# Altium schematic sheet 03 CPU.SchDoc
size 420 x 297 mm
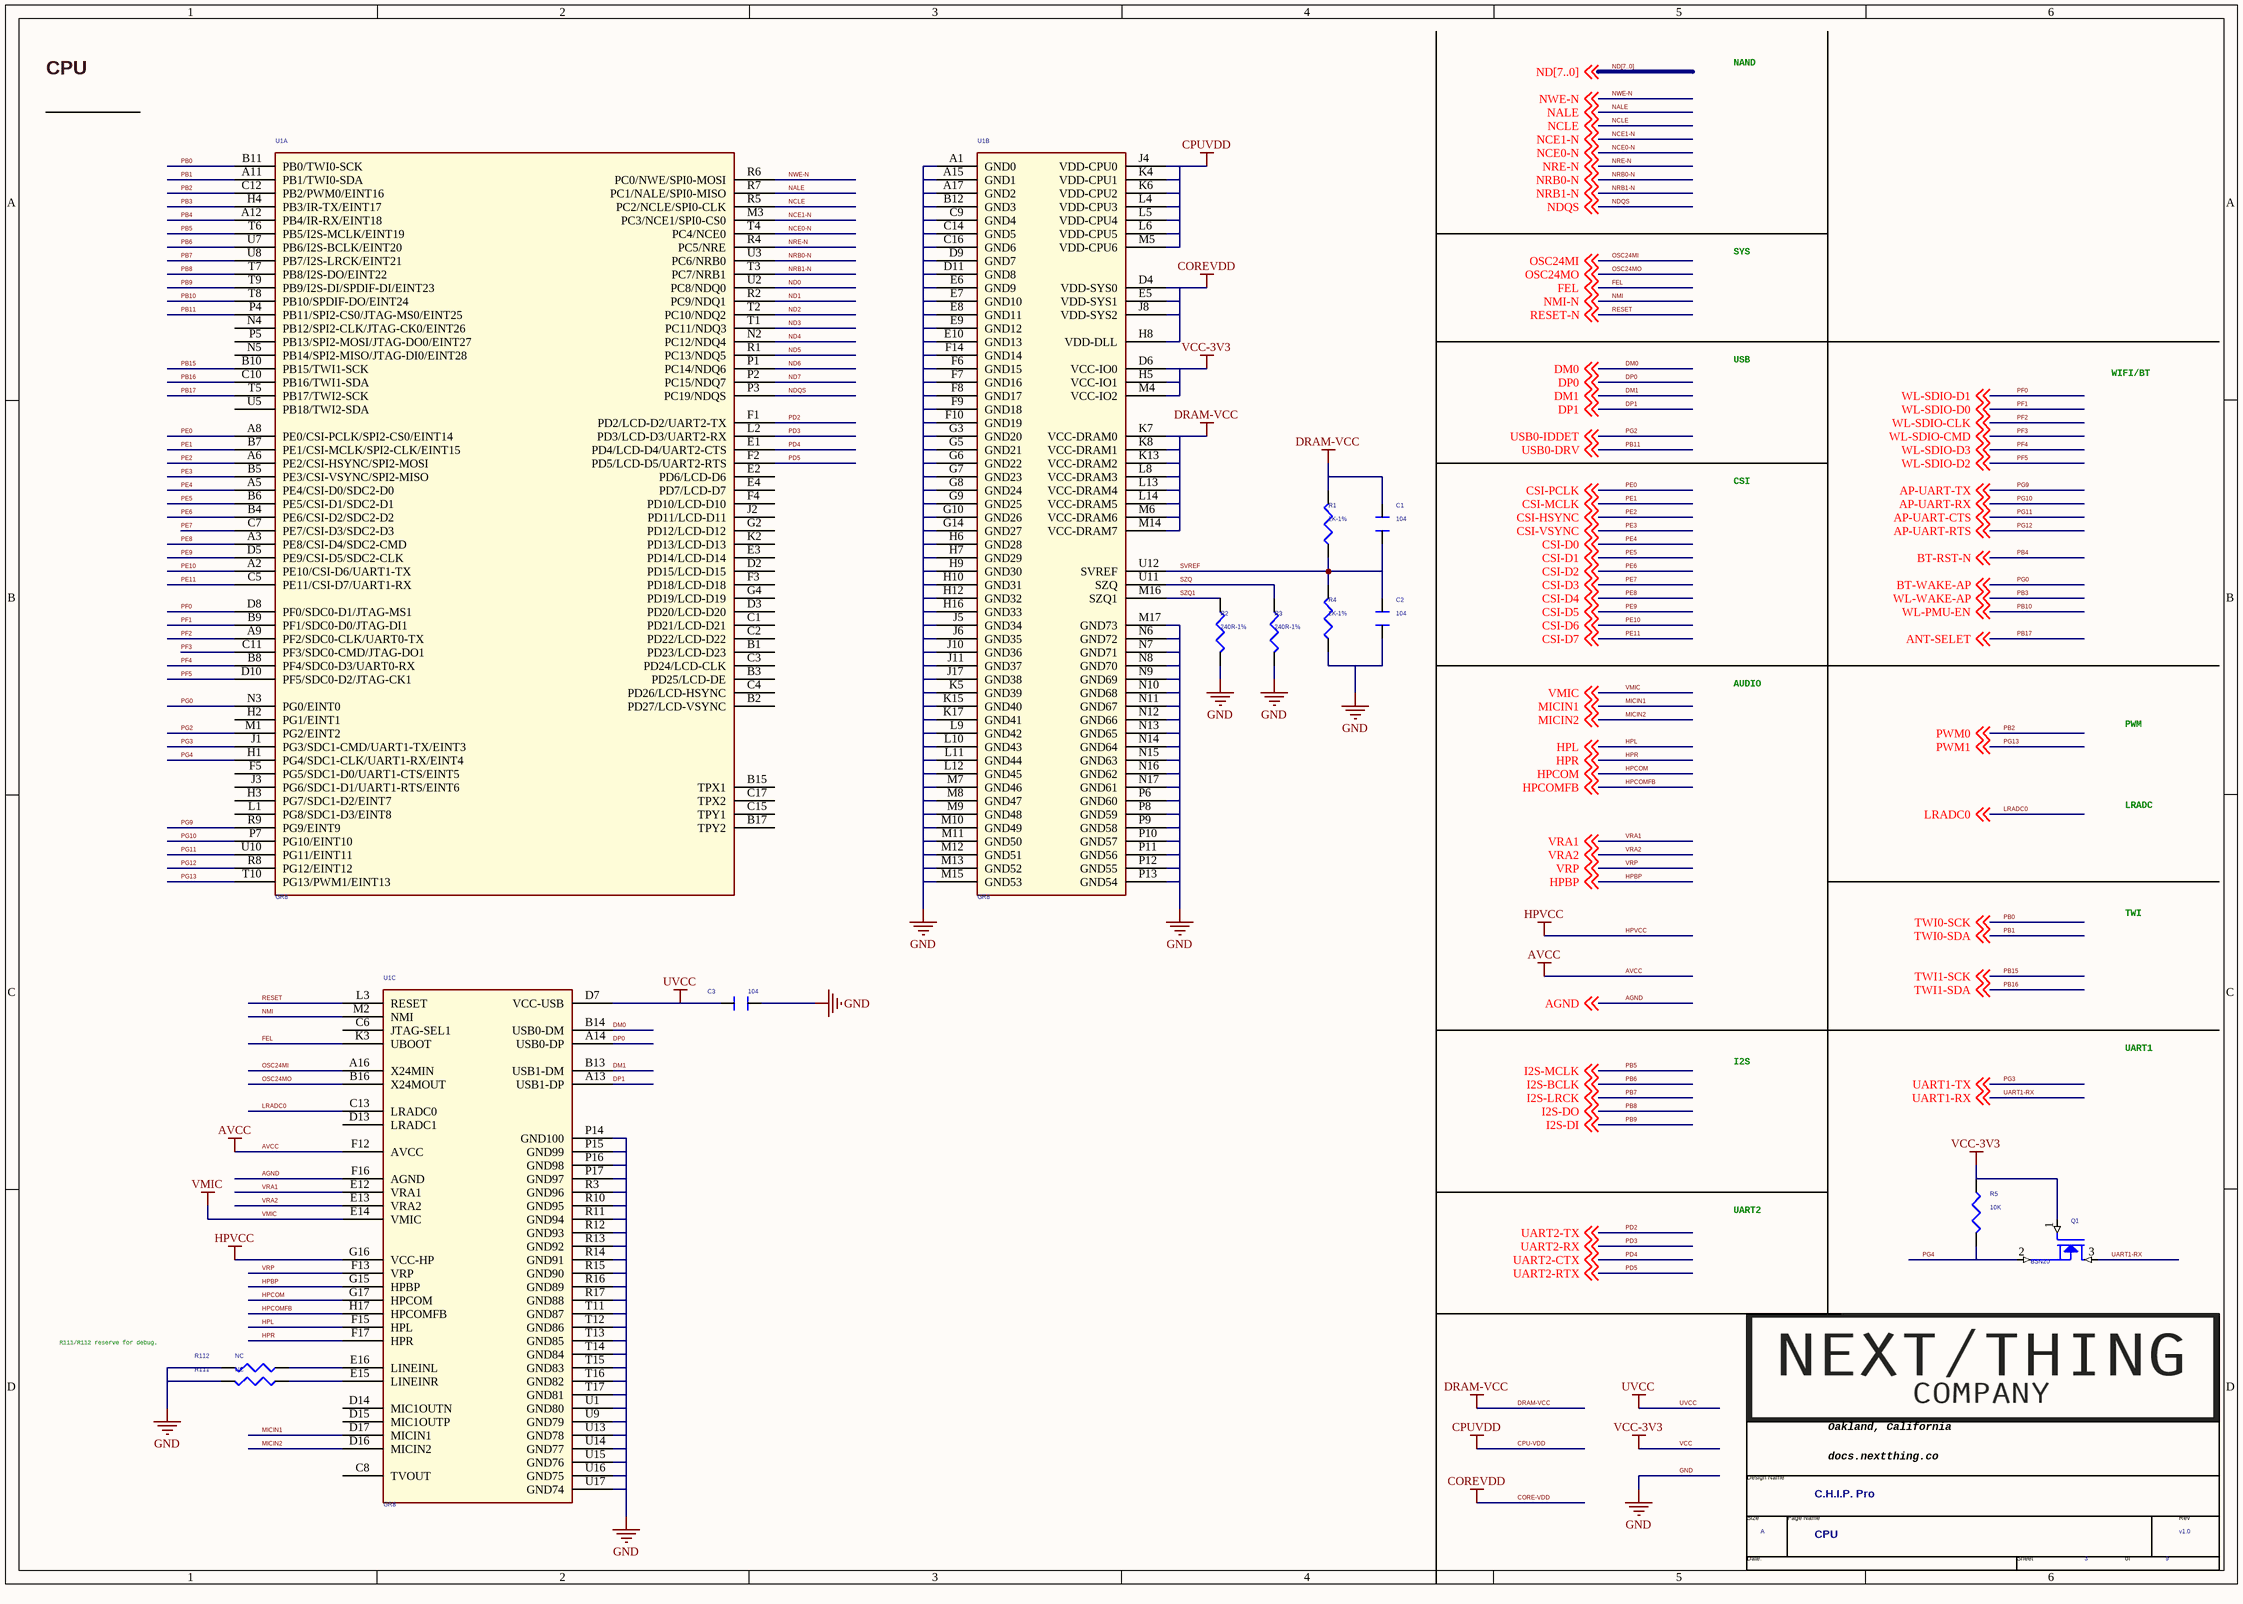
[diagram p0: 03 CPU.SchDoc]

## Parts
*  Page Count: 9  Page Number: 3  Page Size: A  Title: C.H.I.P. Pro  RevCode: v1.0  Doc: CPU  (hidden comment: TitleBlock1-nextthing)  (graphical)
C1  104  [0805]
C2  104  [0805]
C3  104  [C0201]
Q1  BSN20  [sot-23]
R1  2K-1%  [0805]
R2  240R-1%  [R0201]
R3  240R-1%  [R0201]
R4  2K-1%  [0805]
R5  10K  [0805]
R111  NC  [R0603]
R112  NC  [R0603]
U1  GR8  [BGA252P80B1400_1400]  (parts A,B,C of 3)

## Nets
AVCC: U1.F12(AVCC)
CORE-VDD: U1.D4(VDD-SYS0) U1.E5(VDD-SYS1) U1.H8(VDD-DLL) U1.J8(VDD-SYS2)  [also labelled COREVDD]
CPU-VDD: U1.J4(VDD-CPU0) U1.K4(VDD-CPU1) U1.K6(VDD-CPU2) U1.L4(VDD-CPU3) U1.L5(VDD-CPU4) U1.L6(VDD-CPU5) U1.M5(VDD-CPU6)  [also labelled CPUVDD]
DRAM-VCC: C1.1 R1.2 U1.K7(VCC-DRAM0) U1.K8(VCC-DRAM1) U1.K13(VCC-DRAM2) U1.L8(VCC-DRAM3) U1.L13(VCC-DRAM4) U1.L14(VCC-DRAM5) U1.M6(VCC-DRAM6) U1.M14(VCC-DRAM7)
GND: C2.2 C3.1 R2.1 R3.1 R4.1 R111.2 R112.1 U1.A1(GND0) U1.A15(GND1) U1.A17(GND2) U1.B12(GND3) U1.C9(GND4) U1.C14(GND5) U1.C16(GND6) U1.D9(GND7) U1.D11(GND8) U1.E6(GND9) U1.E7(GND10) U1.E8(GND11) U1.E9(GND12) U1.E10(GND13) U1.F6(GND15) U1.F7(GND16) U1.F8(GND17) U1.F9(GND18) U1.F10(GND19) U1.F14(GND14) U1.G3(GND20) U1.G5(GND21) U1.G6(GND22) U1.G7(GND23) U1.G8(GND24) U1.G9(GND25) U1.G10(GND26) U1.G14(GND27) U1.H6(GND28) U1.H7(GND29) U1.H9(GND30) U1.H10(GND31) U1.H12(GND32) U1.H16(GND33) U1.J5(GND34) U1.J6(GND35) U1.J10(GND36) U1.J11(GND37) U1.J17(GND38) U1.K5(GND39) U1.K15(GND40) U1.K17(GND41) U1.L9(GND42) U1.L10(GND43) U1.L11(GND44) U1.L12(GND45) U1.M7(GND46) U1.M8(GND47) U1.M9(GND48) U1.M10(GND49) U1.M11(GND50) U1.M12(GND51) U1.M13(GND52) U1.M15(GND53) U1.M17(GND73) U1.N6(GND72) U1.N7(GND71) U1.N8(GND70) U1.N9(GND69) U1.N10(GND68) U1.N11(GND67) U1.N12(GND66) U1.N13(GND65) U1.N14(GND64) U1.N15(GND63) U1.N16(GND62) U1.N17(GND61) U1.P6(GND60) U1.P8(GND59) U1.P9(GND58) U1.P10(GND57) U1.P11(GND56) U1.P12(GND55) U1.P13(GND54) U1.P14(GND100) U1.P15(GND99) U1.P16(GND98) U1.P17(GND97) U1.R3(GND96) U1.R10(GND95) U1.R11(GND94) U1.R12(GND93) U1.R13(GND92) U1.R14(GND91) U1.R15(GND90) U1.R16(GND89) U1.R17(GND88) U1.T11(GND87) U1.T12(GND86) U1.T13(GND85) U1.T14(GND84) U1.T15(GND83) U1.T16(GND82) U1.T17(GND81) U1.U1(GND80) U1.U9(GND79) U1.U13(GND78) U1.U14(GND77) U1.U15(GND76) U1.U16(GND75) U1.U17(GND74)
HPVCC: U1.G16(VCC-HP)
UVCC: C3.2 U1.D7(VCC-USB)
VCC: Q1.1(GATE) R5.1 U1.D6(VCC-IO0) U1.H5(VCC-IO1) U1.M4(VCC-IO2)  [also labelled VCC-3V3]
VMIC: U1.E14(VMIC) ; off-sheet VMIC
AGND: U1.F16(AGND) ; off-sheet AGND
DM0: U1.B14(USB0-DM) ; off-sheet DM0
DM1: U1.B13(USB1-DM) ; off-sheet DM1
DP0: U1.A14(USB0-DP) ; off-sheet DP0
DP1: U1.A13(USB1-DP) ; off-sheet DP1
FEL: U1.K3(UBOOT) ; off-sheet FEL
HPBP: U1.G15(HPBP) ; off-sheet HPBP
HPCOM: U1.G17(HPCOM) ; off-sheet HPCOM
HPCOMFB: U1.H17(HPCOMFB) ; off-sheet HPCOMFB
HPL: U1.F15(HPL) ; off-sheet HPL
HPR: U1.F17(HPR) ; off-sheet HPR
LRADC0: U1.C13(LRADC0) ; off-sheet LRADC0
MICIN1: U1.D17(MICIN1) ; off-sheet MICIN1
MICIN2: U1.D16(MICIN2) ; off-sheet MICIN2
NALE: U1.R7(PC1/NALE/SPI0-MISO) ; off-sheet NALE
NCE0-N: U1.T4(PC4/NCE0) ; off-sheet NCE0-N
NCE1-N: U1.M3(PC3/NCE1/SPI0-CS0) ; off-sheet NCE1-N
NCLE: U1.R5(PC2/NCLE/SPI0-CLK) ; off-sheet NCLE
ND0: U1.U2(PC8/NDQ0)
ND1: U1.R2(PC9/NDQ1)
ND2: U1.T2(PC10/NDQ2)
ND3: U1.T1(PC11/NDQ3)
ND4: U1.N2(PC12/NDQ4)
ND5: U1.R1(PC13/NDQ5)
ND6: U1.P1(PC14/NDQ6)
ND7: U1.P2(PC15/NDQ7)
NDQS: U1.P3(PC19/NDQS) ; off-sheet NDQS
NMI: U1.M2(NMI) ; off-sheet NMI-N  [also labelled NMI-N]
NRB0-N: U1.U3(PC6/NRB0) ; off-sheet NRB0-N
NRB1-N: U1.T3(PC7/NRB1) ; off-sheet NRB1-N
NRE-N: U1.R4(PC5/NRE) ; off-sheet NRE-N
NWE-N: U1.R6(PC0/NWE/SPI0-MOSI) ; off-sheet NWE-N
OSC24MI: U1.A16(X24MIN) ; off-sheet OSC24MI
OSC24MO: U1.B16(X24MOUT) ; off-sheet OSC24MO
PB0: U1.B11(PB0/TWI0-SCK) ; off-sheet TWI0-SCK  [also labelled TWI0-SCK]
PB1: U1.A11(PB1/TWI0-SDA) ; off-sheet TWI0-SDA  [also labelled TWI0-SDA]
PB2: U1.C12(PB2/PWM0/EINT16) ; off-sheet PWM0  [also labelled PWM0]
PB3: U1.H4(PB3/IR-TX/EINT17) ; off-sheet WL-WAKE-AP  [also labelled WL-WAKE-AP]
PB4: U1.A12(PB4/IR-RX/EINT18) ; off-sheet BT-RST-N  [also labelled BT-RST-N]
PB5: U1.T6(PB5/I2S-MCLK/EINT19) ; off-sheet I2S-MCLK  [also labelled I2S-MCLK]
PB6: U1.U7(PB6/I2S-BCLK/EINT20) ; off-sheet I2S-BCLK  [also labelled I2S-BCLK]
PB7: U1.U8(PB7/I2S-LRCK/EINT21) ; off-sheet I2S-LRCK  [also labelled I2S-LRCK]
PB8: U1.T7(PB8/I2S-DO/EINT22) ; off-sheet I2S-DO  [also labelled I2S-DO]
PB9: U1.T9(PB9/I2S-DI/SPDIF-DI/EINT23) ; off-sheet I2S-DI  [also labelled I2S-DI]
PB10: U1.T8(PB10/SPDIF-DO/EINT24) ; off-sheet WL-PMU-EN  [also labelled WL-PMU-EN]
PB11: U1.P4(PB11/SPI2-CS0/JTAG-MS0/EINT25) ; off-sheet USB0-DRV  [also labelled USB0-DRV]
PB15: U1.B10(PB15/TWI1-SCK) ; off-sheet TWI1-SCK  [also labelled TWI1-SCK]
PB16: U1.C10(PB16/TWI1-SDA) ; off-sheet TWI1-SDA  [also labelled TWI1-SDA]
PB17: U1.T5(PB17/TWI2-SCK) ; off-sheet ANT-SELET  [also labelled ANT-SELET]
PD2: U1.F1(PD2/LCD-D2/UART2-TX) ; off-sheet UART2-TX  [also labelled UART2-TX]
PD3: U1.L2(PD3/LCD-D3/UART2-RX) ; off-sheet UART2-RX  [also labelled UART2-RX]
PD4: U1.E1(PD4/LCD-D4/UART2-CTS) ; off-sheet UART2-CTX  [also labelled UART2-CTX]
PD5: U1.F2(PD5/LCD-D5/UART2-RTS) ; off-sheet UART2-RTX  [also labelled UART2-RTX]
PE0: U1.A8(PE0/CSI-PCLK/SPI2-CS0/EINT14) ; off-sheet CSI-PCLK  [also labelled CSI-PCLK]
PE1: U1.B7(PE1/CSI-MCLK/SPI2-CLK/EINT15) ; off-sheet CSI-MCLK  [also labelled CSI-MCLK]
PE2: U1.A6(PE2/CSI-HSYNC/SPI2-MOSI) ; off-sheet CSI-HSYNC  [also labelled CSI-HSYNC]
PE3: U1.B5(PE3/CSI-VSYNC/SPI2-MISO) ; off-sheet CSI-VSYNC  [also labelled CSI-VSYNC]
PE4: U1.A5(PE4/CSI-D0/SDC2-D0) ; off-sheet CSI-D0  [also labelled CSI-D0]
PE5: U1.B6(PE5/CSI-D1/SDC2-D1) ; off-sheet CSI-D1  [also labelled CSI-D1]
PE6: U1.B4(PE6/CSI-D2/SDC2-D2) ; off-sheet CSI-D2  [also labelled CSI-D2]
PE7: U1.C7(PE7/CSI-D3/SDC2-D3) ; off-sheet CSI-D3  [also labelled CSI-D3]
PE8: U1.A3(PE8/CSI-D4/SDC2-CMD) ; off-sheet CSI-D4  [also labelled CSI-D4]
PE9: U1.D5(PE9/CSI-D5/SDC2-CLK) ; off-sheet CSI-D5  [also labelled CSI-D5]
PE10: U1.A2(PE10/CSI-D6/UART1-TX) ; off-sheet CSI-D6  [also labelled CSI-D6]
PE11: U1.C5(PE11/CSI-D7/UART1-RX) ; off-sheet CSI-D7  [also labelled CSI-D7]
PF0: U1.D8(PF0/SDC0-D1/JTAG-MS1) ; off-sheet WL-SDIO-D1  [also labelled WL-SDIO-D1]
PF1: U1.B9(PF1/SDC0-D0/JTAG-DI1) ; off-sheet WL-SDIO-D0  [also labelled WL-SDIO-D0]
PF2: U1.A9(PF2/SDC0-CLK/UART0-TX) ; off-sheet WL-SDIO-CLK  [also labelled WL-SDIO-CLK]
PF3: U1.C11(PF3/SDC0-CMD/JTAG-DO1) ; off-sheet WL-SDIO-CMD  [also labelled WL-SDIO-CMD]
PF4: U1.B8(PF4/SDC0-D3/UART0-RX) ; off-sheet WL-SDIO-D3  [also labelled WL-SDIO-D3]
PF5: U1.D10(PF5/SDC0-D2/JTAG-CK1) ; off-sheet WL-SDIO-D2  [also labelled WL-SDIO-D2]
PG0: U1.N3(PG0/EINT0) ; off-sheet BT-WAKE-AP  [also labelled BT-WAKE-AP]
PG2: U1.M1(PG2/EINT2) ; off-sheet USB0-IDDET  [also labelled USB0-IDDET]
PG3: U1.J1(PG3/SDC1-CMD/UART1-TX/EINT3) ; off-sheet UART1-TX  [also labelled UART1-TX]
PG4: Q1.2(SOURCE) R5.2 U1.H1(PG4/SDC1-CLK/UART1-RX/EINT4)
PG9: U1.R9(PG9/EINT9) ; off-sheet AP-UART-TX  [also labelled AP-UART-TX]
PG10: U1.P7(PG10/EINT10) ; off-sheet AP-UART-RX  [also labelled AP-UART-RX]
PG11: U1.U10(PG11/EINT11) ; off-sheet AP-UART-CTS  [also labelled AP-UART-CTS]
PG12: U1.R8(PG12/EINT12) ; off-sheet AP-UART-RTS  [also labelled AP-UART-RTS]
PG13: U1.T10(PG13/PWM1/EINT13) ; off-sheet PWM1  [also labelled PWM1]
RESET: U1.L3(RESET) ; off-sheet RESET-N  [also labelled RESET-N]
SVREF: C1.2 C2.1 R1.1 R4.2 U1.U12(SVREF)
SZQ: R3.2 U1.U11(SZQ)
SZQ1: R2.2 U1.M16(SZQ1)
UART1-RX: Q1.3(DRAIN) ; off-sheet UART1-RX
VRA1: U1.E12(VRA1) ; off-sheet VRA1
VRA2: U1.E13(VRA2) ; off-sheet VRA2
VRP: U1.F13(VRP) ; off-sheet VRP
NetR111_1: R111.1 U1.E15(LINEINR)
NetR112_2: R112.2 U1.E16(LINEINL)

Not connected (* = marked no-connect by the designer): U1 B1(PD23/LCD-D23) B2(PD27/LCD-VSYNC) B3(PD25/LCD-DE) B15(TPX1) B17(TPY2) C1(PD21/LCD-D21) C2(PD22/LCD-D22) C3(PD24/LCD-CLK) C4(PD26/LCD-HSYNC) C6(JTAG-SEL1) C8(TVOUT) C15(TPY1) C17(TPX2) D2(PD15/LCD-D15) D3(PD20/LCD-D20) D13(LRADC1) D14(MIC1OUTN) D15(MIC1OUTP) E2(PD6/LCD-D6) E3(PD14/LCD-D14) E4(PD7/LCD-D7) F3(PD18/LCD-D18) F4(PD10/LCD-D10) F5(PG5/SDC1-D0/UART1-CTS/EINT5) G2(PD12/LCD-D12) G4(PD19/LCD-D19) H2(PG1/EINT1) H3(PG7/SDC1-D2/EINT7) J2(PD11/LCD-D11) J3(PG6/SDC1-D1/UART1-RTS/EINT6) K2(PD13/LCD-D13) L1(PG8/SDC1-D3/EINT8) N4(PB12/SPI2-CLK/JTAG-CK0/EINT26) N5(PB14/SPI2-MISO/JTAG-DI0/EINT28) P5(PB13/SPI2-MOSI/JTAG-DO0/EINT27) U5(PB18/TWI2-SDA)

## Buses and harness runs
bus ND[7..0]

## Notes on the sheet
- CPU
- NAND
- SYS
- USB
- WIFI/BT
- CSI
- AUDIO
- PWM
- LRADC
- TWI
- I2S
- UART1
- UART2
- R111/R112 reserve for debug.
- (in symbol TitleBlock1-nextthing) Oakland, California; Design Name; docs.nextthing.co /; Size; Page Name; Rev; Date:; Sheet; of

## Library data of the parts
C1 C2 = CAP_0
C3 = CAPACITOR_0_Dup4: PAGE: 3
Q1 = NMOS_xp151_SOT23
R1 R4 = R1 0805
R2 R3 = R_Dup2
R5 = R1_0805: ROOM: DRAM
R111 R112 = RESISTOR_0
U1 = GR8_BGA252: SPLIT_INST: TRUE
* = TitleBlock1-nextthing: Page Create Date: March  8, 1995